# EAGLE design PIC32_WIZ810MJ (EAGLE 6.4)
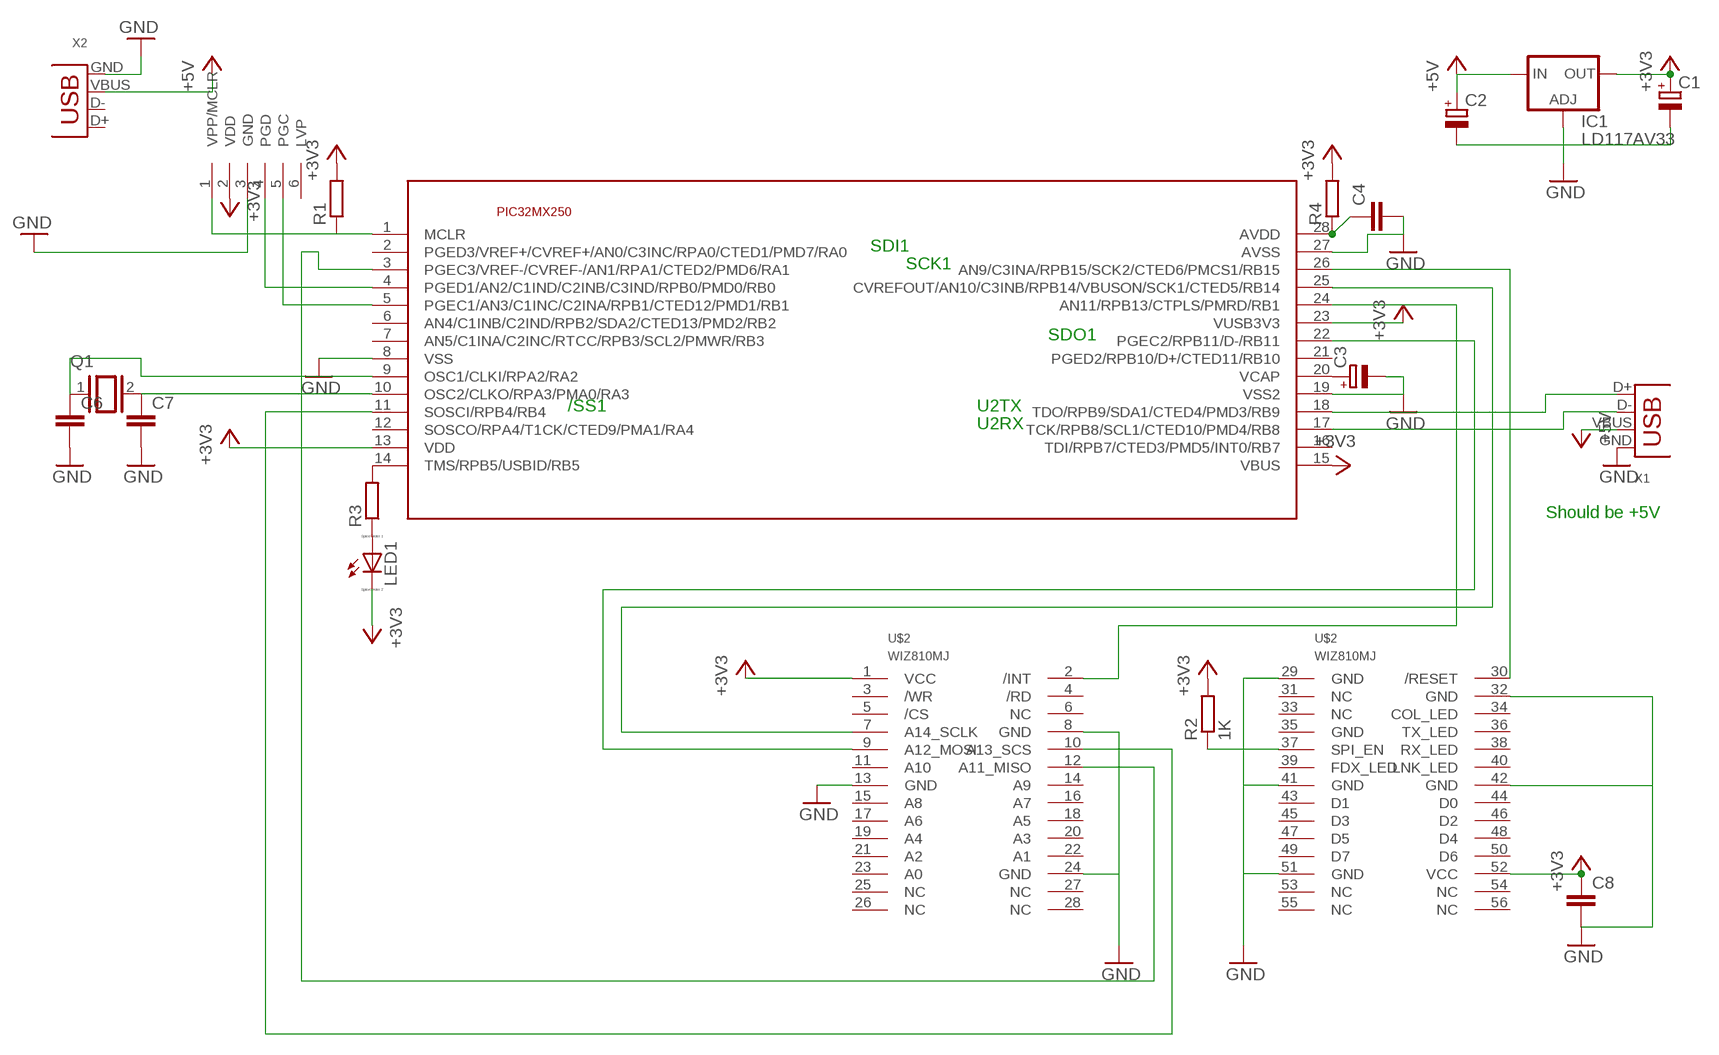
[diagram p0: schematic, sheet 1]

## Parts
C1  CPOL-EUE3.5-10  [E3,5-10]
C2  CPOL-EUE3.5-10  [E3,5-10]
C3  CPOL-EUE2.5-6  [E2,5-6]
C4  C-EU050-055X075  [C050-055X075]
C6  C-EU025-025X050  [C025-025X050]
C7  C-EU025-025X050  [C025-025X050]
C8  C-EU050-055X075  [C050-055X075]
IC1  LD117AV33  [TO220L1]
LED1  LED_ELD260  [LED_LD260]
Q1  XTAL/S  [QS]
R1  R-EU_0204/5  [0204/5]
R2  1K  R-EU_0204/5  [0204/5]
R3  R-EU_0204/5  [0204/5]
R4  R-EU_0204/5  [0204/5]
U$1  PIC32MX2XXDIP28_SLIM  [DIP254P762X508-28]
U$2  WIZ810MJ  [WIZ810MJ]
U$3  ICSP-6_6P  [1X06-CLEANBIG]
X1  USB-A-H  [USB-A-H]
X2  USB-B-H  [USB-B-H]

## Nets
+3V3: C1.+ C8.1 IC1.2(OUT) LED1.K(C) R1.2 R2.2 R4.2 U$1.13(VDD) U$1.15(VBUS) U$1.23(VUSB3V3) U$2.1(VCC) U$2.52(VCC) U$3.2(VDD)
+5V: C2.+ IC1.3(IN) X1.VBUS X2.VBUS
GND: C1.- C2.- C3.- C4.2 C6.2 C7.2 C8.2 IC1.1(ADJ) U$1.8(VSS) U$1.19(VSS2) U$1.27(AVSS) U$2.8(GND) U$2.13(GND) U$2.24(GND) U$2.29(GND) U$2.32(GND) U$2.41(GND) U$2.42(GND) U$2.51(GND) U$3.3(GND) X1.GND X2.GND
N$1: U$1.22(PGEC2/RPB11/D-/RB11) U$2.9(A12_MOSI)
N$2: U$1.3(PGEC3/VREF-/CVREF-/AN1/RPA1/CTED2/PMD6/RA1) U$2.12(A11_MISO)
N$3: U$1.25(CVREFOUT/AN10/C3INB/RPB14/VBUSON/SCK1/CTED5/RB14) U$2.7(A14_SCLK)
N$4: R1.1 U$1.1(MCLR) U$3.1(VPP/MCLR)
N$5: U$1.11(SOSCI/RPB4/RB4) U$2.10(A13_SCS)
N$6: U$1.4(PGED1/AN2/C1IND/C2INB/C3IND/RPB0/PMD0/RB0) U$3.4(PGD)
N$7: U$1.26(AN9/C3INA/RPB15/SCK2/CTED6/PMCS1/RB15) U$2.30(/RESET)
N$8: U$1.5(PGEC1/AN3/C1INC/C2INA/RPB1/CTED12/PMD1/RB1) U$3.5(PGC)
N$9: U$1.18(TDO/RPB9/SDA1/CTED4/PMD3/RB9) X1.D+
N$10: U$1.17(TCK/RPB8/SCL1/CTED10/PMD4/RB8) X1.D-
N$11: R2.1 U$2.37(SPI_EN)
N$12: C4.1 R4.1 U$1.28(AVDD)
N$13: U$1.24(AN11/RPB13/CTPLS/PMRD/RB1) U$2.2(/INT)
N$14: C6.1 Q1.1 U$1.9(OSC1/CLKI/RPA2/RA2)
N$15: C7.1 Q1.2 U$1.10(OSC2/CLKO/RPA3/PMA0/RA3)
N$20: R3.2 U$1.14(TMS/RPB5/USBID/RB5)
N$21: LED1.A R3.1
N$22: C3.+ U$1.20(VCAP)
Unconnected: U$1.2(PGED3/VREF+/CVREF+/AN0/C3INC/RPA0/CTED1/PMD7/RA0) U$1.6(AN4/C1INB/C2IND/RPB2/SDA2/CTED13/PMD2/RB2) U$1.7(AN5/C1INA/C2INC/RTCC/RPB3/SCL2/PMWR/RB3) U$1.12(SOSCO/RPA4/T1CK/CTED9/PMA1/RA4) U$1.16(TDI/RPB7/CTED3/PMD5/INT0/RB7) U$1.21(PGED2/RPB10/D+/CTED11/RB10) U$2.3(/WR) U$2.4(/RD) U$2.5(/CS) U$2.6(NC) U$2.11(A10) U$2.14(A9) U$2.15(A8) U$2.16(A7) U$2.17(A6) U$2.18(A5) U$2.19(A4) U$2.20(A3) U$2.21(A2) U$2.22(A1) U$2.23(A0) U$2.25(NC) U$2.26(NC) U$2.27(NC) U$2.28(NC) U$2.31(NC) U$2.33(NC) U$2.34(COL_LED) U$2.35(GND) U$2.36(TX_LED) U$2.38(RX_LED) U$2.39(FDX_LED) U$2.40(LNK_LED) U$2.43(D1) U$2.44(D0) U$2.45(D3) U$2.46(D2) U$2.47(D5) U$2.48(D4) U$2.49(D7) U$2.50(D6) U$2.53(NC) U$2.54(NC) U$2.55(NC) U$2.56(NC) U$3.6(LVP) X2.D+ X2.D-

## Notes on the sheet
- SDI1
- SCK1
- SDO1
- /SS1 | U2TX
- U2RX
- Should be +5V

## Library data of the parts
C1-C3 = rcl:CPOL-EU: POLARIZED CAPACITOR, European symbol
C4 C6-C8 = rcl:C-EU: CAPACITOR, European symbol
IC1 = v-reg:LD117A?*: Low drop fixed and adjustable positive voltage regulators 1 A Source: http://www.st.com/stonline/products/literature/ds/7194/ld1117axx.pdf
LED1 = eagle-ltspice:LED_E: LED Source: http://www.osram.convergy.de Source: www.luxeon.com Source: www.kingbright.com; SPICEMODEL: NONE; SPICEPREFIX: D; SPICETYPE: diode
Q1 = special:XTAL/S: CRYSTAL
R1-R4 = rcl:R-EU_: RESISTOR, European symbol
U$1 = lieven:PIC32MX2XX
U$2 = WIZNET:WIZ810MJ
U$3 = lieven:ICSP-6
X1 X2 = lieven:USB: USB Connectors

## Board
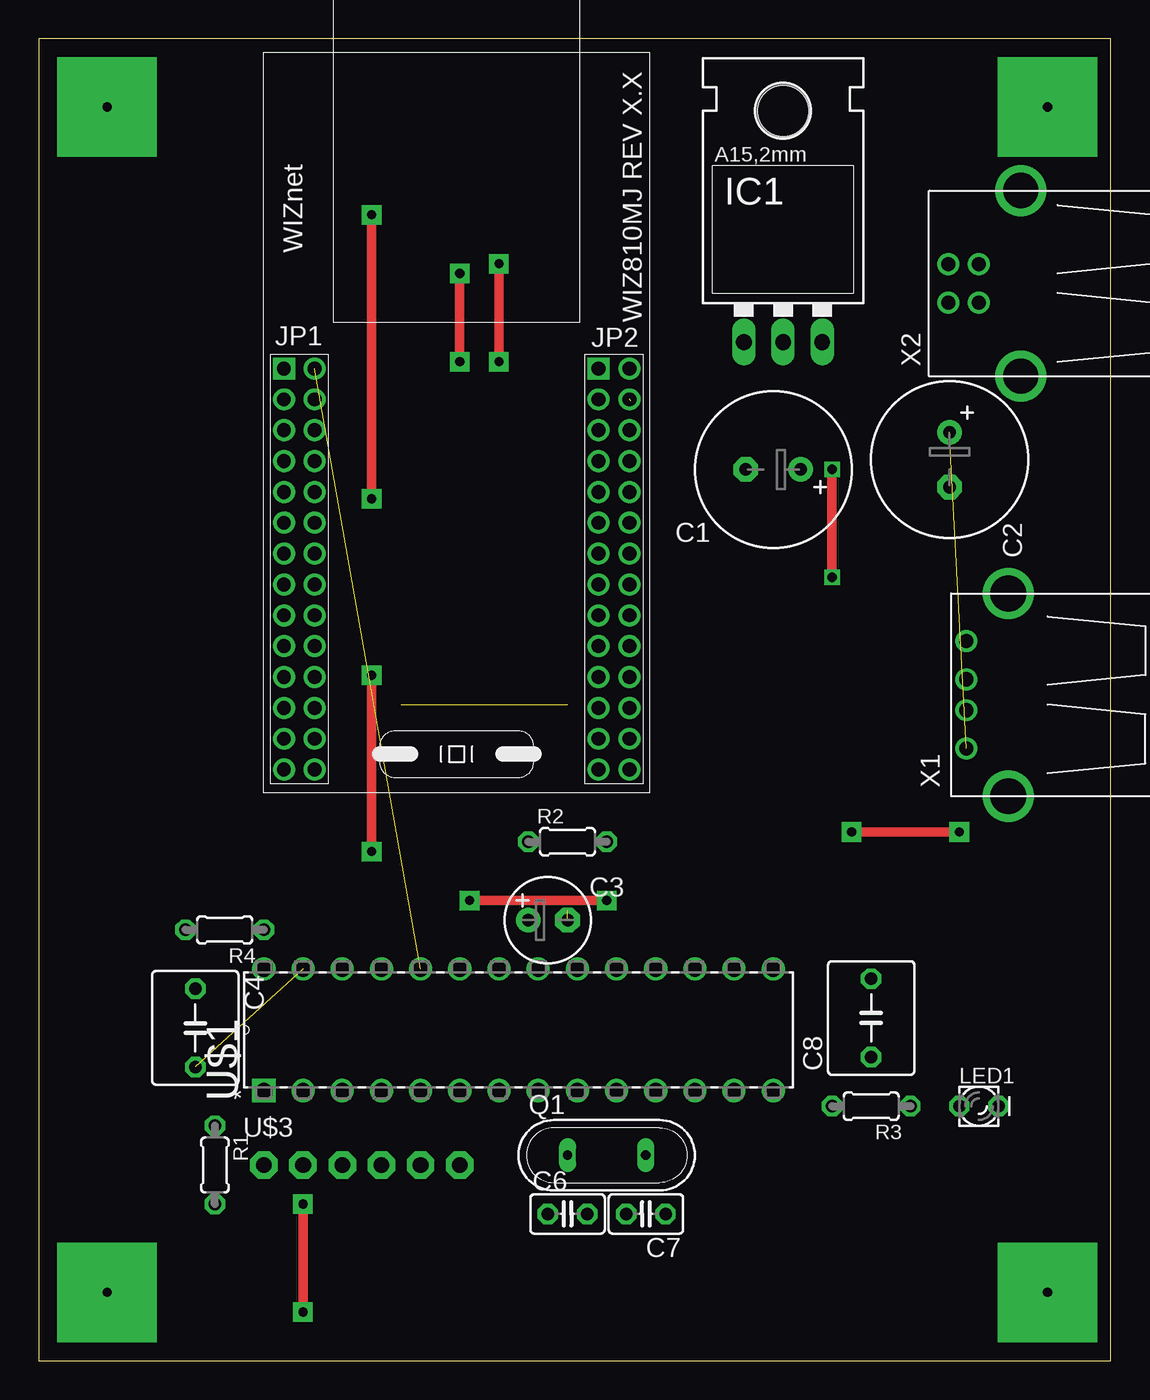
[diagram p1: board, top side]
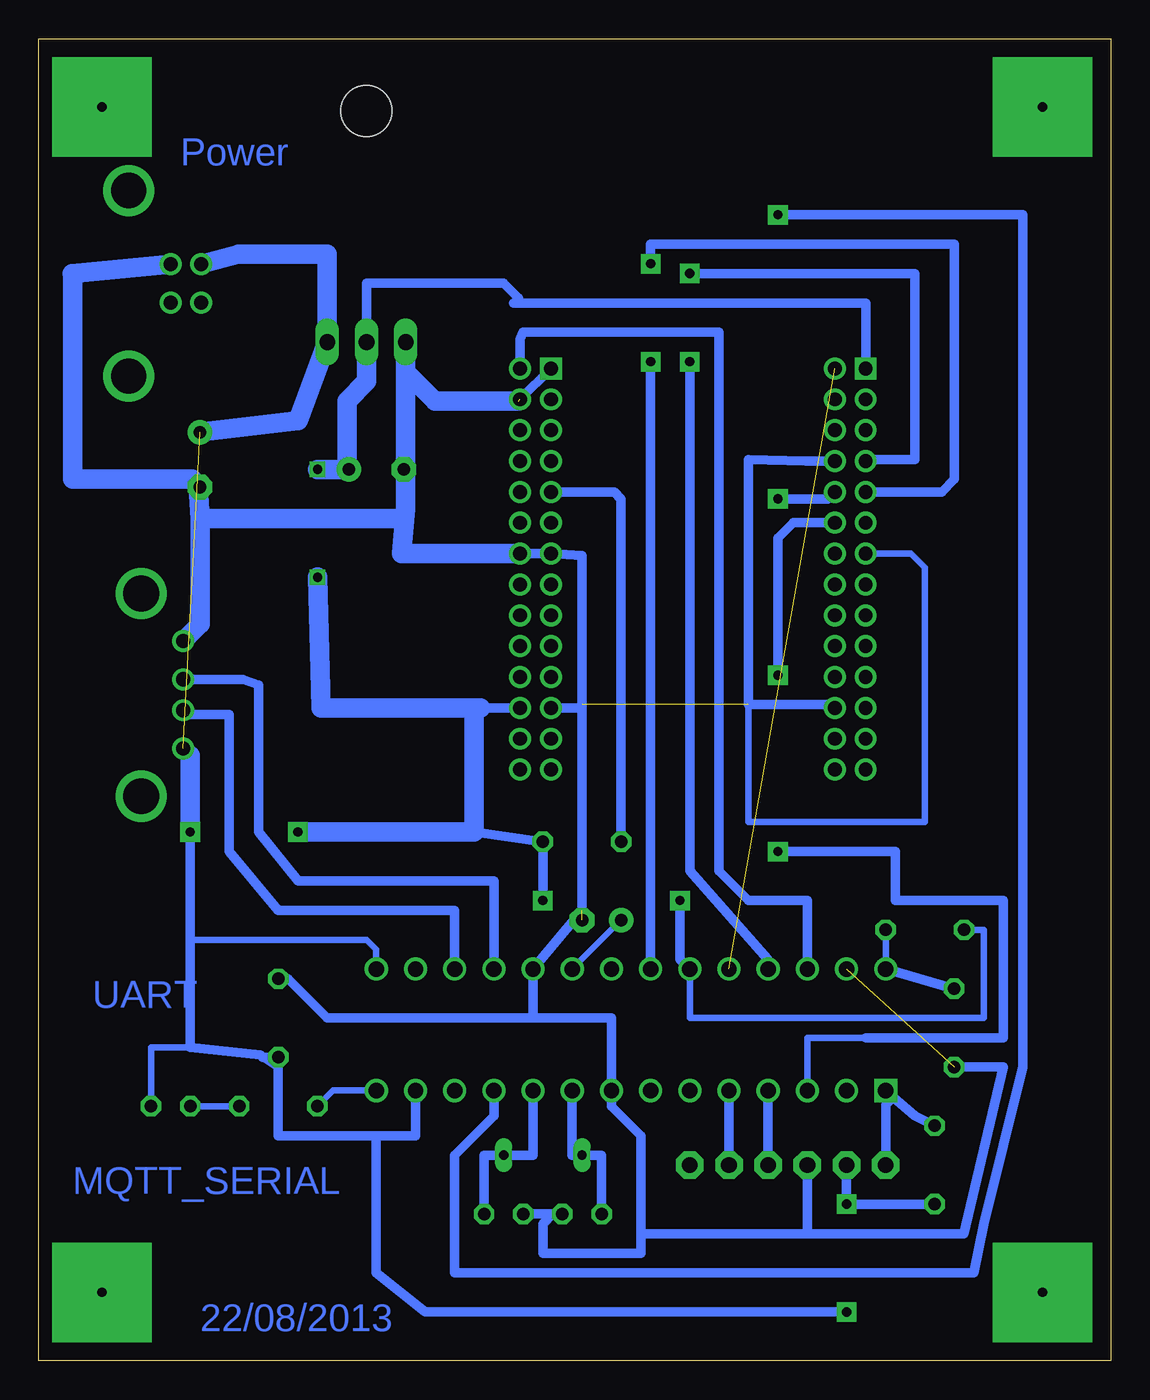
[diagram p2: board, bottom side, seen from below]

Size 69.52 x 85.72 mm. Coordinates in mm from the lower left corner, seen from the top.
Outline: 0,0 69.52,0 69.52,85.72 0,85.72 0,0
Copper layers (1*16): Top 0.035mm / dielectric 1.5mm / Bottom 0.035mm
Design rules "default": minimum track width 10mil, minimum drill 24mil, track to track 8mil, track to pad 8mil, pad to pad 8mil, via to via 8mil, smd to smd 8mil, copper to edge 40mil, drill to drill 8mil, minimum pad ring 10mil, minimum via ring 8mil, stop-mask expansion 4mil, vias tented up to drill 0mil, thermal gap 10mil

### Footprints (pad centres in the part's own frame; a part is rotated, then mirrored left to right if it is on the bottom)
E3,5-10 = drill 0.813 pad 1.6: + -1.778,0 | drill 0.813 pad 1.6 octagon: - 1.778,0
E2,5-6 = drill 0.813 pad 1.6: + -1.27,0 | drill 0.813 pad 1.6 octagon: - 1.27,0
C050-055X075 = drill 0.813 octagon: 1 -2.54,0; 2 2.54,0
C025-025X050 = drill 0.813 octagon: 1 -1.27,0; 2 1.27,0
TO220L1 = drill 1.016 long: 1 -2.54,-3.81; 2 0,-3.81; 3 2.54,-3.81 | hole 3.302: 0,11.176
LED_LD260 = drill 0.813 octagon: A -1.27,0; K 1.27,0
QS = drill 0.61 long: 1 -2.54,0; 2 2.54,0
0204/5 = drill 0.813 octagon: 1 -2.54,0; 2 2.54,0
DIP254P762X508-28 = drill 0.991 square: 1 -7.874,33.02 | drill 0.991: 2 -7.874,30.48; 3 -7.874,27.94; 4 -7.874,25.4; 5 -7.874,22.86; 6 -7.874,20.32; 7 -7.874,17.78; 8 -7.874,15.24; 9 -7.874,12.7; 10 -7.874,10.16; 11 -7.874,7.62; 12 -7.874,5.08; 13 -7.874,2.54; 14 -7.874,0; 15 0,0; 16 0,2.54; 17 0,5.08; 18 0,7.62; 19 0,10.16; 20 0,12.7; 21 0,15.24; 22 0,17.78; 23 0,20.32; 24 0,22.86; 25 0,25.4; 26 0,27.94; 27 0,30.48; 28 0,33.02
WIZ810MJ = drill 0.9 pad 1.422 square: 1 27.5,-1.3; 29 27.5,-21.7 | drill 0.9 pad 1.422: 2 27.5,-3.3; 3 25.5,-1.3; 4 25.5,-3.3; 5 23.5,-1.3; 6 23.5,-3.3; 7 21.5,-1.3; 8 21.5,-3.3; 9 19.5,-1.3; 10 19.5,-3.3; 11 17.5,-1.3; 12 17.5,-3.3; 13 15.5,-1.3; 14 15.5,-3.3; 15 13.5,-1.3; 16 13.5,-3.3; 17 11.5,-1.3; 18 11.5,-3.3; 19 9.5,-1.3; 20 9.5,-3.3; 21 7.5,-1.3; 22 7.5,-3.3; 23 5.5,-1.3; 24 5.5,-3.3; 25 3.5,-1.3; 26 3.5,-3.3; 27 1.5,-1.3; 28 1.5,-3.3; 30 27.5,-23.7; 31 25.5,-21.7; 32 25.5,-23.7; 33 23.5,-21.7; 34 23.5,-23.7; 35 21.5,-21.7; 36 21.5,-23.7; 37 19.5,-21.7; 38 19.5,-23.7; 39 17.5,-21.7; 40 17.5,-23.7; 41 15.5,-21.7; 42 15.5,-23.7; 43 13.5,-21.7; 44 13.5,-23.7; 45 11.5,-21.7; 46 11.5,-23.7; 47 9.5,-21.7; 48 9.5,-23.7; 49 7.5,-21.7; 50 7.5,-23.7; 51 5.5,-21.7; 52 5.5,-23.7; 53 3.5,-21.7; 54 3.5,-23.7; 55 1.5,-21.7; 56 1.5,-23.7
1X06-CLEANBIG = drill 1.016 pad 1.778 octagon: 1 -6.35,0; 2 -3.81,0; 3 -1.27,0; 4 1.27,0; 5 3.81,0; 6 6.35,0
USB-A-H = drill 0.914: D+ 2.718,-1.003; D- 2.718,1.003; GND 2.718,-3.493; VBUS 2.718,3.493 | drill 2.311: P$5 0,-6.566; P$6 0,6.566
USB-B-H = drill 0.914: D+ 0,1.25; D- 1.981,1.25; GND 0,-1.25; VBUS 1.981,-1.25 | drill 2.286: P$1 -2.718,-6.02; P$2 -2.718,6.02

### Placement (x,y rotation side)
C1  47.62,57.78 180 top
C2  59.05,58.42 270 top
C3  33.02,28.57 0 top
C4  10.16,21.59 270 top
C6  34.29,9.53 0 top
C7  39.37,9.53 180 top
C8  53.98,22.23 90 top
IC1  48.26,69.85 0 top
LED1  60.96,16.51 0 top
Q1  36.83,13.34 0 top
R1  11.43,12.7 270 top
R2  34.29,33.66 0 top
R3  53.98,16.51 180 top
R4  12.07,27.94 180 top
U$1  47.62,25.4 90 top
U$2  14.61,36.83 90 top
U$3  20.96,12.7 0 top
X1  62.87,43.18 180 top
X2  60.96,69.85 180 top

### Tracks (layer width: path | path; a pad name or v marks a point on that pad's centre or on a via)
+3V3  (via drill 0.6, 0.6 pad 1.27)
  Top 0.61: v51.44,50.8 v51.44,57.78 | v52.7,34.29 v59.69,34.29 | v36.83,29.84 v27.94,29.84 | v17.14,10.16 v17.14,3.18
  Bottom 0.406: U$1.23 27.3,22.23 8.26,22.23 8.26,27.94 R4.2 | U$1.15 47.62,26.67 48.26,27.3 59.69,27.3 | LED1.K 62.23,20.32 59.69,20.32
  Bottom 0.61: R1.2 v17.14,10.16 U$3.2 | 55.15,19.83 53.98,19.05 53.98,14.61 47.62,14.61 | 55.15,19.83 59.69,20.32 59.69,27.3 v59.69,34.29 | 49.53,57.91 C1.+ | U$2.1 15.91,68.55 16.51,68.58 38.73,68.58 38.42,68.9 39.37,69.85 48.26,69.85 IC1.2 | C8.1 55,19.68 55.15,19.83 | U$2.52 40.85,42.33 41.27,41.91 | 41.27,34.29 R2.2 v36.83,29.84 | 47.62,14.61 45.09,14.61 U$1.13 | v27.94,29.84 27.94,26.04 U$1.23 | v17.14,3.18 44.45,3.18 47.62,5.71 47.62,14.61
  Bottom 1.27: v59.69,34.29 59.69,39.23 | IC1.2 48.26,63.5 49.53,62.23 49.53,57.91 | 41.27,41.91 41.27,34.29 v52.7,34.29 | 40.85,42.33 51.22,42.33 v51.44,50.8 | v51.44,57.78 C1.+
+5V  (1 unrouted)
  Bottom 0.61: 56.53,71.73 56.52,71.75
  Bottom 1.27: X2.VBUS 56.53,71.73 | 56.52,71.75 50.8,71.75 IC1.3 52.7,60.96 C2.+
GND  (4 unrouted)
  Bottom 0.406: U$2.13 12.96,52.33 12.07,51.44 12.07,34.93 23.5,34.93 23.5,42.55
  Bottom 0.61: C7.2 36.2,9.53 | 36.2,9.53 C6.2 | 30.48,8.26 30.48,14.61 32.38,16.51 U$1.8 32.38,22.23 37.47,22.23 | 30.48,8.26 30.48,6.99 36.83,6.99 36.83,8.89 36.2,9.53 | U$3.3 19.68,8.26 | 19.68,8.26 30.48,8.26 | 37.47,22.23 50.8,22.23 53.34,24.77 C8.2 | 37.47,22.23 U$1.19 34.29,29.21 34.29,42.55 | C2.- 59.05,54.61 | 45.72,57.91 C1.- 45.72,57.66 | C2.- 59.18,56.64 | 46.35,54.61 45.72,55.24 | IC1.1 45.72,64.14 | 67.33,70.47 67.31,70.48 | 59.56,57.15 C2.- | 34.29,42.55 34.29,52.22 U$2.41 U$2.42 | C4.2 6.99,19.05 9.53,8.26 19.68,8.26 | U$2.24 18.12,42.55 23.5,42.55 23.5,58.42 19.77,58.33 U$2.8 | U$2.51 34.51,42.33 34.29,42.55 | U$2.32 U$2.29
  Bottom 1.27: 59.05,54.61 59.05,47.77 X1.GND | IC1.1 45.72,57.91 | 59.18,56.64 59.05,54.61 | 59.05,54.61 46.35,54.61 | 45.72,57.66 45.72,55.24 45.98,52.33 U$2.42 | 45.72,64.14 43.81,62.23 38.41,62.23 | X2.GND 67.33,70.47 | 67.31,70.48 67.31,57.15 59.56,57.15
N$1  (via drill 0.6 pad 1.27)
  Top 0.61: v29.84,64.77 v29.84,71.12
  Bottom 0.61: U$1.22 v29.84,64.77 | v29.84,71.12 29.84,72.39 10.16,72.39 10.16,57.15 10.98,56.33 U$2.9
N$2  (via drill 0.6 pad 1.27)
  Top 0.61: v21.59,44.45 v21.59,33.02
  Bottom 0.406: U$1.3 19.68,20.96 15.24,20.96
  Bottom 0.61: U$2.12 20.6,54.33 21.59,53.34 v21.59,44.45 | v21.59,33.02 13.97,33.02 13.97,29.84 6.99,29.84 6.99,20.96 15.24,20.96 15.88,20.96
N$3  (via drill 0.6 pad 1.27)
  Top 0.61: v27.3,64.77 v27.3,70.48
  Bottom 0.61: U$1.25 22.23,26.04 27.3,31.75 v27.3,64.77 | v27.3,70.48 12.7,70.48 12.7,58.42 15.82,58.42 U$2.7
N$4
  Bottom 0.61: U$1.1 14.1,17.09 | 14.1,17.09 12.7,15.88 R1.1 | U$3.1 14.61,16.59 14.1,17.09
N$5  (via drill 0.6 pad 1.27)
  Top 0.61: v21.59,74.3 v21.59,55.88
  Bottom 0.61: U$1.11 40.01,15.88 42.55,13.34 42.55,5.71 8.89,5.71 8.26,8.89 5.71,19.05 5.71,74.3 v21.59,74.3 | v21.59,55.88 18.36,55.88 U$2.10
N$6
  Bottom 0.61: U$1.4 U$3.4
N$7
  Bottom 0.61: U$2.30 38.3,66.25 38.1,66.67 25.4,66.67 25.4,31.75 23.5,29.84 19.68,29.84 U$1.26
N$8
  Bottom 0.61: U$1.5 U$3.5
N$9
  Bottom 0.61: X1.D+ 56.25,44.18 55.24,43.81 55.24,34.29 52.7,31.11 40.01,31.11 U$1.18
N$10
  Bottom 0.61: U$1.17 42.55,29.21 53.98,29.21 57.15,33.02 57.15,41.91 59.88,41.91 X1.D-
N$11
  Bottom 0.61: U$2.37 32.2,56.33 31.75,55.88 R2.1
N$12
  Bottom 0.406: U$1.28 R4.1
  Bottom 0.61: U$1.28 C4.1
N$13  (1 unrouted)
N$14
  Bottom 0.61: C6.1 33.02,13.34 Q1.1 34.93,13.34 U$1.9
N$15
  Bottom 0.61: U$1.10 37.47,13.34 Q1.2 40.64,13.34 C7.1
N$16  (via drill 0.6 pad 6.45)
  other vias: 4.45,81.28
N$17  (via drill 0.6 pad 6.45)
  other vias: 65.41,4.45
N$18  (via drill 0.6 pad 6.45)
  other vias: 65.41,81.28
N$19  (via drill 0.6 pad 6.45)
  other vias: 4.45,4.45
N$20
  Bottom 0.406: U$1.14 50.42,17.53 R3.2
N$21
  Bottom 0.406: R3.1 LED1.A
N$22
  Bottom 0.406: U$1.20 C3.+

### Text on the board
Bottom: Power | UART | MQTT_SERIAL | 22/08/2013